# EAGLE design LoLin32-Lora (EAGLE 7.7.0)
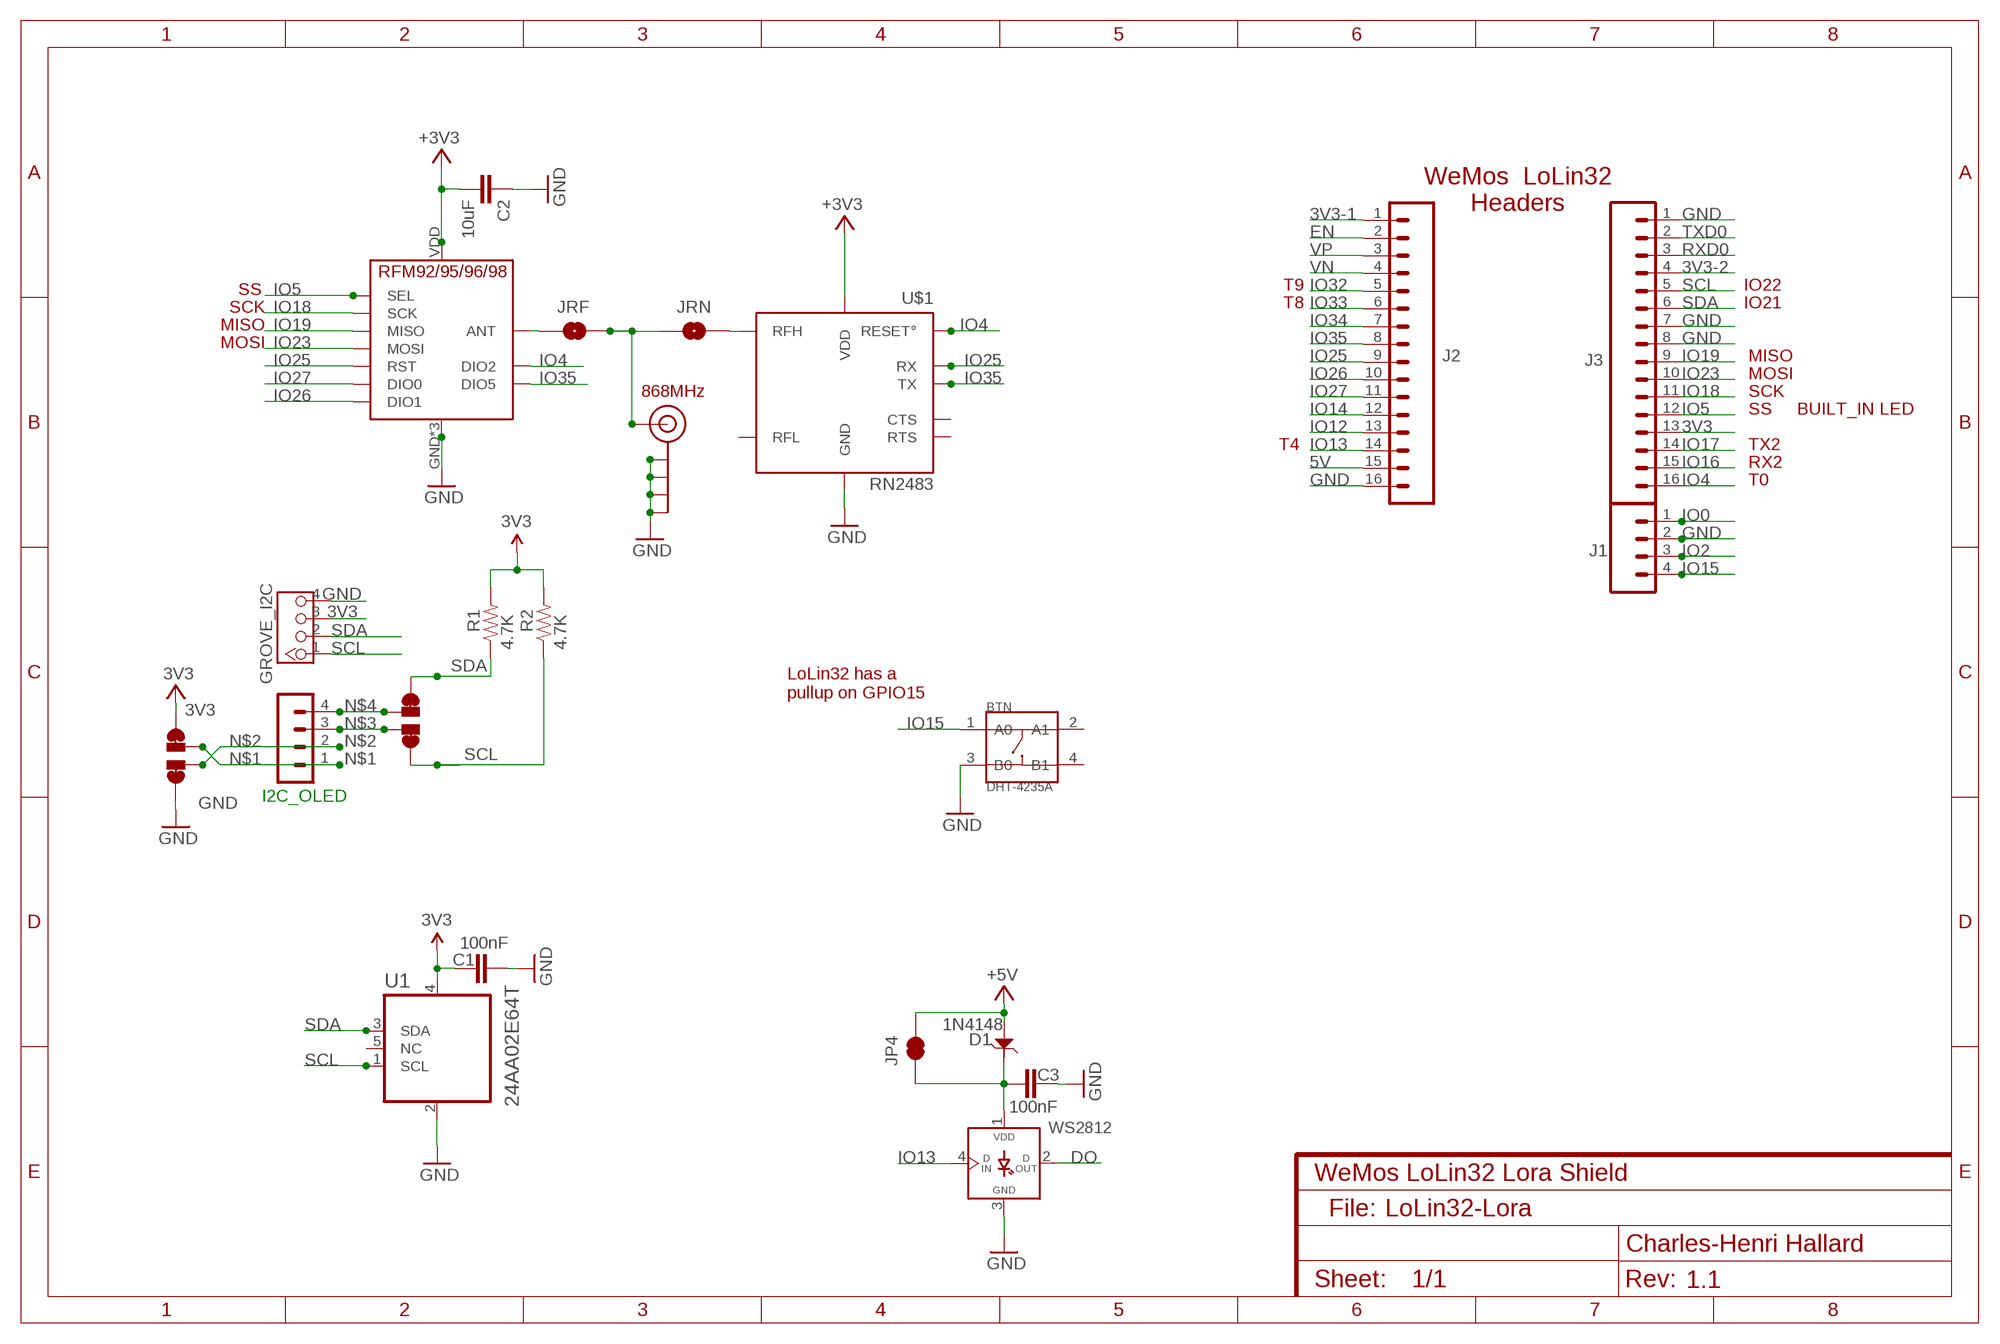
[diagram p0: schematic, sheet 1]
NAME (FRAME-A4L): CNAME: WeMos LoLin32 Lora Shield; CREVISION: 1.1; DESIGNER: Charles-Henri Hallard

## Parts
BTN  DHT-4235A  SMD-BUTTON-TOP-DHT-4235A(4P-4.2X3.2MM)  [SW4-SMD-4.2X3.2X2.5MM]
C1  100nF  CAP0805-CAP  [0805-CAP]
C2  10uF  CAP0805-CAP-LARGEPADS  [0805-CAP-LARGEPADS]
C3  100nF  CAP0805-CAP  [0805-CAP]
D1  1N4148  D-ESD-2P-CESD5V0D1  [SOD123-2.7X1.6]
GROVE_I2C  4P-2.0  GROVE-CONNECTOR-DIP(4P-2.0)  [HW4-2.0]
I2C_OLED  CON_HEADER_1X04'NO_LOCK'  [1X04_NO_LOCK]
J1  M041X04_NO_SILK  [1X04_NO_SILK]
J2  M161X16_NO_SILK  [1X16_NO_SILK]
J3  M161X16_NO_SILK  [1X16_NO_SILK]
J$2  ANTENNATINY  [SMA_UFL_PAD_TINY]
JP4  JUMPER-PAD-2-NC_BY_TRACE  [PAD-JUMPER-2-NC_BY_TRACE_YES_SILK]
JRF  JUMPER-PAD-2-NO  [PAD-JUMPER-2-NO_NO_SILK]
JRN  JUMPER-PAD-2-NO  [PAD-JUMPER-2-NO_NO_SILK]
R1  4.7K  RESISTOR0805-RES  [0805-RES]
R2  4.7K  RESISTOR0805-RES  [0805-RES]
U1  24AA02E64T  24AA02E64T-I/OT  [SOT95P270X145-5N]
U$1  RN2483  RN2483_NOGPIO868  [RN2483_NOGPIO_868]
U$2  PAD-JUMPER-SWAPSWAP  [PAD-JUMPER-SWAP]
U$3  PAD-JUMPER-SWAPSWAP  [PAD-JUMPER-SWAP]
U$5  RFM95  [RFM95]
WS2812  WS2812B  WS2812BSMD  [WS2812B]

## Nets
3V3: C2.2 GROVE_I2C.3 J3.13 R1.2 R2.2 U$1.VDD U$1.VDD2(VDD) U$2.4 U$2.44 U$5.VDD(VCC) ; supply symbol labelled +3V3
3V3-1: J2.1
3V3-2: C1.1 J3.4 U1.4(VCC) ; supply symbol labelled 3V3
5V: D1.1 J2.15 JP4.2 ; supply symbol labelled +5V
DO: WS2812.2(DOUT)
EN: J2.2
GND: BTN.3(B0) C1.2 C2.1 C3.2 GROVE_I2C.4 J1.2 J2.16 J3.1 J3.7 J3.8 J$2.GND1(GND) J$2.GND2(GND) J$2.GND3(GND) J$2.GND4(GND) U1.2(VSS) U$1.GND U$1.GND3(GND) U$1.GND4(GND) U$1.GND7(GND) U$1.GND9(GND) U$1.GND11(GND) U$1.GND12(GND) U$2.1 U$2.11 U$5.GND U$5.GND1(GND) U$5.GND2(GND) WS2812.3(GND)
IO0: J1.1
IO2: J1.3
IO4: J3.16 U$1.RESET° U$5.DIO2
IO5: J3.12 U$5.NSS(SEL)
IO12: J2.13
IO13: J2.14 WS2812.4(DIN)
IO14: J2.12
IO15: BTN.1(A0) J1.4
IO16: J3.15
IO17: J3.14
IO18: J3.11 U$5.SCK
IO19: J3.9 U$5.MISO
IO23: J3.10 U$5.MOSI
IO25: J2.9 U$1.UART_RX(RX) U$5.RST
IO26: J2.10 U$5.DIO1
IO27: J2.11 U$5.DIO0
IO32: J2.5
IO33: J2.6
IO34: J2.7
IO35: J2.8 U$1.UART_TX(TX) U$5.DIO5
N$1: I2C_OLED.1 U$2.3
N$2: I2C_OLED.2 U$2.2
N$3: I2C_OLED.3 U$3.2
N$4: I2C_OLED.4 U$3.3
N$5: JRN.2 U$1.RFH
N$6: JRF.1 U$5.ANT
N$7: J$2.ANT1(SIGNAL) J$2.ANT2(SIGNAL) J$2.ANT3(SIGNAL) JRF.2 JRN.1
RXD0: J3.3
SCL: GROVE_I2C.1 J3.5 R2.1 U1.1(SCL) U$3.1 U$3.11
SDA: GROVE_I2C.2 J3.6 R1.1 U1.3(SDA) U$3.4 U$3.44
TXD0: J3.2
VLED: C3.1 D1.2 JP4.1 WS2812.1(VDD)
VN: J2.4
VP: J2.3
Unconnected: BTN.2(A1) BTN.4(B1) U1.5(NC) U$1.RFL U$1.UART_CTS(CTS) U$1.UART_RTS(RTS)

## Notes on the sheet
- WeMos  LoLin32
  Headers
- SS | T9 | IO22
- SCK | T8 | IO21
- MISO
- MOSI
- MISO
- MOSI
- 868MHz | SCK
- SS | BUILT_IN LED
- T4 | TX2
- RX2
- T0
- LoLin32 has a 
  pullup on GPIO15
- File:

## Library data of the parts
BTN = Switch-2016:SMD-BUTTON-TOP-DHT-4235A(4P-4.2X3.2MM): 311020045; MPN: DHT-4235A
C1-C3 = _c2h:CAP: Capacitor Standard 0603 ceramic capacitor, and 0.1" leaded capacitor.
D1 = Seeed-Discrete:D-ESD-2P: Diodes for Protectiong against ESD
GROVE_I2C = _c2h:GROVE-CONNECTOR-DIP(4P-2.0): 320110033
I2C_OLED = _c2h:CON_HEADER_1X04
J1 = SparkFun-Connectors:M04: Header 4 Standard 4-pin 0.1" header. Use with straight break away headers (SKU : PRT-00116), right angle break away headers (PRT-00553), swiss pins (PRT-00743), machine pins (PRT-00117), and female headers (PRT-00115). Molex polarized connector foot print use with SKU : PRT-08231 with associated crimp pins and housings. 1MM SMD Version SKU: PRT-10208; PROD_ID: CONN-09696
J2 J3 = SparkFun-Connectors:M16: 1x16 .1" header
J$2 = _c2h:ANTENNA: SMA Antenna Connector End launch SMA connector. The paste layer has been removed so that the connector can be hand soldered onto the board after reflow.
JP4 = SparkFun-Passives:JUMPER-PAD-2-NC_BY_TRACE
JRF JRN = SparkFun-Passives:JUMPER-PAD-2-NO
R1 R2 = _c2h:RESISTOR: Resistor Basic schematic elements and footprints for 0603, 1206, and PTH resistors.
U1 = Microchip-24AA02E64T:24AA02E64T-I/OT: 2K I2C™ Serial EEPROMs, SOT23-5; MPN: 24AA02E64T-I/OT; OC_FARNELL: 2345567; OC_NEWARK: 01X0461; PACKAGE: SOT23-5; SUPPLIER: Microchip
U$1 = _c2h:RN2483_NOGPIO
U$2 U$3 = _c2h:PAD-JUMPER-SWAP
U$5 = _c2h:RFM95
WS2812 = _c2h:WS2812B

## Net classes
0 default: width 0.203 mm, drill 0.356 mm, clearance 0.152 mm
1 power: width 0.203 mm, clearance 0.152 mm

## Board
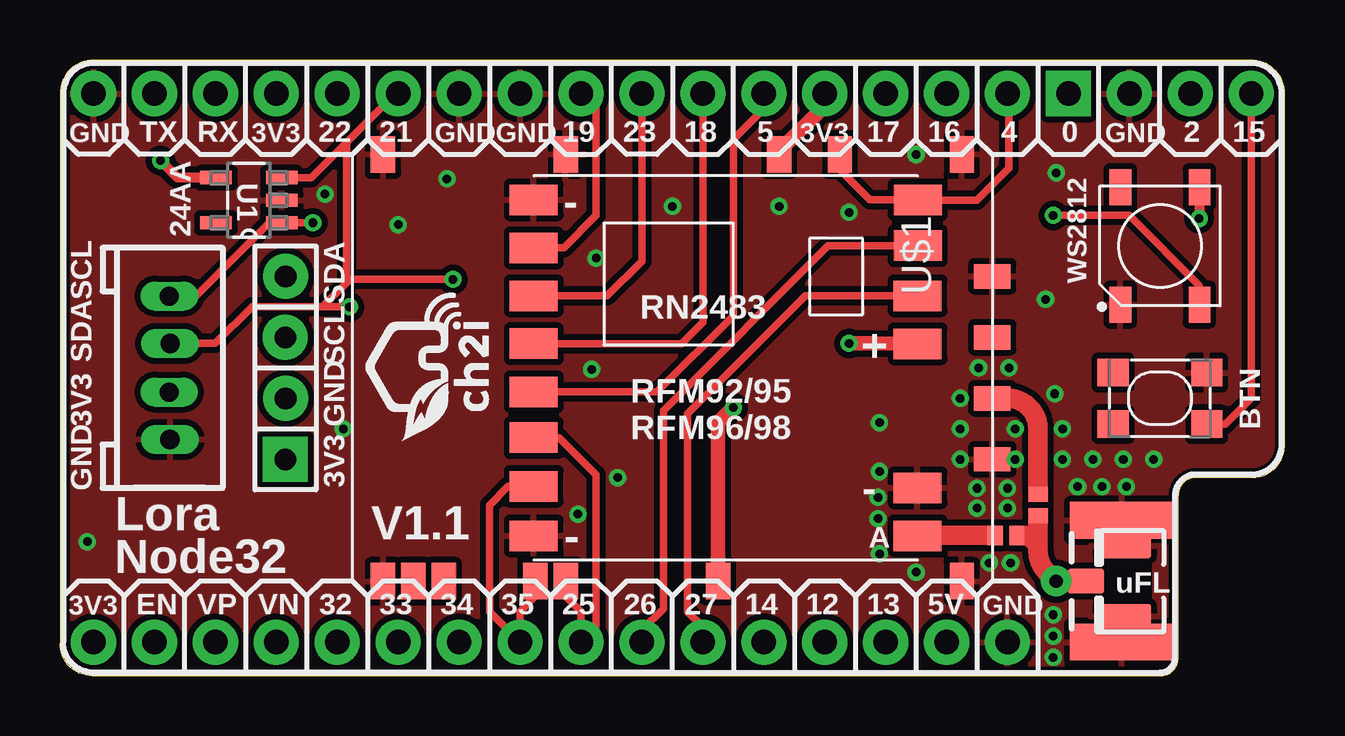
[diagram p1: board, top side]
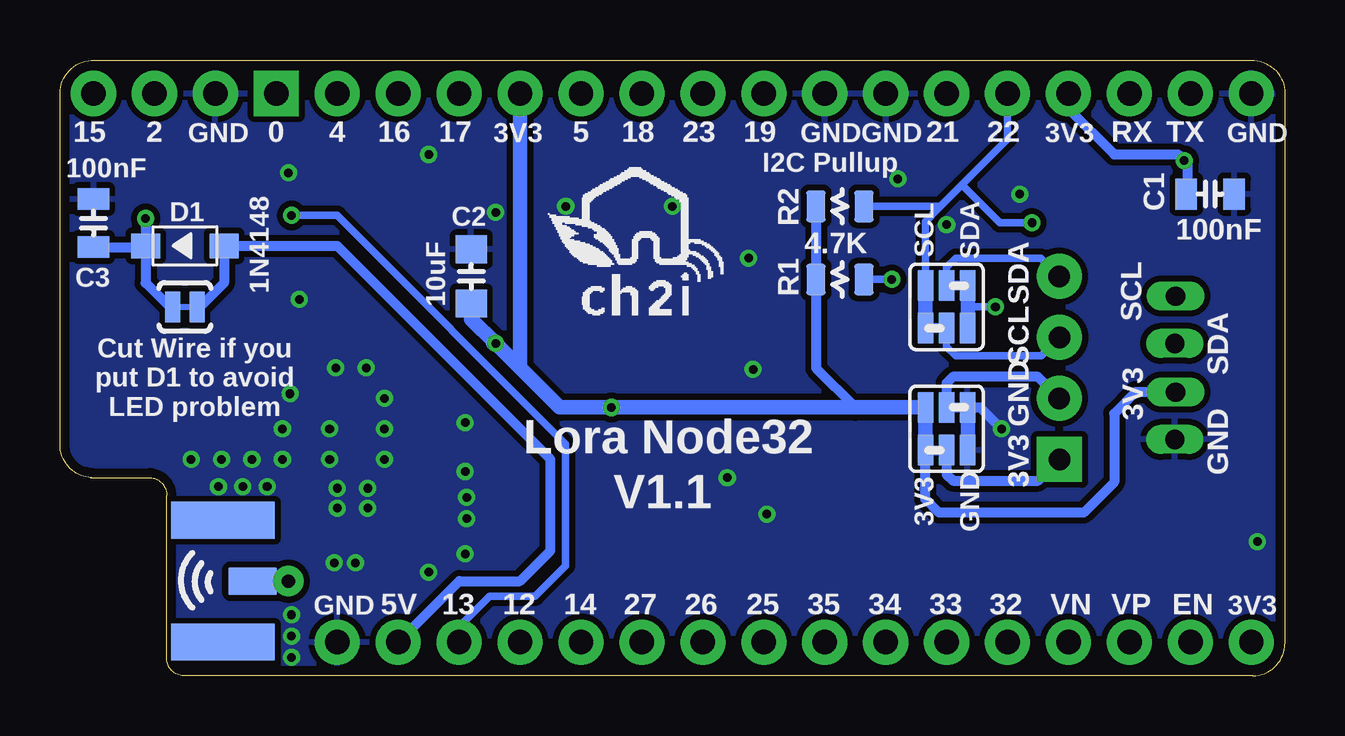
[diagram p2: board, bottom side, seen from below]

Size 51.05 x 25.65 mm. Coordinates in mm from the lower left corner, seen from the top.
Outline: 1.4,25.65 49.62,25.65 arc-90 51.05,24.26 51.05,9.65 arc-90 49.72,8.25
Outline: 1.4,25.65 1.37,25.65
Outline: 1.4,25.65 arc90 0,24.26 0,1.33 arc90 1.33,0 45.91,0 arc90 46.61,0.76 46.61,7.49 arc-90 47.31,8.25
Outline: 49.78,8.25 47.31,8.25
Outline: 47.31,8.25 47.24,8.25
Copper layers (1*16): Top 0.0356mm / dielectric 1.5011mm / Bottom 0.0356mm
Design rules "PCBs_io": minimum track width 6mil, minimum drill 13mil, track to track 6mil, track to pad 6mil, pad to pad 6mil, via to via 6mil, smd to smd 6mil, copper to edge 15mil, drill to drill 6mil, minimum pad ring 7mil, minimum via ring 7mil, stop-mask expansion 3mil, vias tented up to drill 40mil, thermal gap 10mil

### Footprints (pad centres in the part's own frame; a part is rotated, then mirrored left to right if it is on the bottom)
SW4-SMD-4.2X3.2X2.5MM = smd 1.3 x 1.15: 1 -1.95,1.075; 2 1.95,1.075; 3 -1.95,-1.075; 4 1.95,-1.075
0805-CAP = smd 0.902 x 1.3: 1 -1,0; 2 1,0
0805-CAP-LARGEPADS = smd 1.156 x 1.3: 1 -1.127,0; 2 1.127,0
SOD123-2.7X1.6 = smd 1.2 x 1.02: 1 -1.635,0; 2 1.635,0
HW4-2.0 = drill 0.8 pad 1.143 long: 1 -2.985,-0.015; 2 -1.016,0.016; 3 1.016,-0.016; 4 2.985,0.015
1X04_NO_LOCK = drill 0.9 pad 1.88 square: 1 -3.816,-0.121 | drill 0.9 pad 1.88: 2 -1.27,-0.133; 3 1.27,-0.121; 4 3.81,-0.133
1X04_NO_SILK = drill 1.016 pad 1.88 square: 1 0,0 | drill 1.016 pad 1.88: 2 2.54,0; 3 5.08,0; 4 7.62,0
1X16_NO_SILK = drill 1.016 pad 1.88: 1 0,0; 2 2.54,0; 3 5.08,0; 4 7.62,0; 5 10.16,0; 6 12.7,0; 7 15.24,0; 8 17.78,0; 9 20.32,0; 10 22.86,0; 11 25.4,0; 12 27.94,0; 13 30.48,0; 14 33.02,0; 15 35.56,0; 16 38.1,0
SMA_UFL_PAD_TINY = smd 1.524 x 1.016: ANT1 -3.843,0 | drill 0.559 pad 1.27: ANT2 -5.08,0 | smd 2.032 x 1.143 bottom: ANT3 -3.589,0 | smd 2.2 x 1.016: GND1 -2.223,1.47; GND2 -2.223,-1.47 | smd 4.318 x 1.524: GND3 -2.349,-2.54; GND4 -2.349,2.54 | smd 4.318 x 1.524 bottom: GND5 -2.349,2.54; GND6 -2.349,-2.54
PAD-JUMPER-2-NC_BY_TRACE_YES_SILK = smd 0.635 x 1.27: 1 -0.508,0; 2 0.508,0
PAD-JUMPER-2-NO_NO_SILK = smd 0.635 x 0.813: 1 -0.45,0; 2 0.45,0
0805-RES = smd 0.8 x 1.3: 1 -1,0; 2 1,0
SOT95P270X145-5N = smd 1.321 x 0.559: 1 -1.372,0.94; 2 -1.372,0; 3 -1.372,-0.94; 4 1.372,-0.94; 5 1.372,0.94
RN2483_NOGPIO_868 = smd 1.524 x 1.016: GND 17.78,1.27; GND3 17.78,25.4; GND9 0,25.4; GND11 0,8.89; GND12 0,1.27; RESET° 0,20.32; UART_CTS 17.78,3.81; UART_RTS 17.78,2.54; UART_RX 17.78,8.89; UART_TX 17.78,7.62; VDD 17.78,15.24; VDD2 0,17.78 | smd 1.016 x 1.524: GND4 12.7,26.67; GND7 5.08,26.67; RFH 10.16,26.67; RFL 7.62,26.67
PAD-JUMPER-SWAP = smd 0.635 x 1.27: 1 -0.876,0.889; 2 0,-0.889; 3 0,0.889; 4 0.876,-0.889; 11 -0.876,-0.889; 44 0.876,0.889
RFM95 = smd 2 x 1.27: ANT 5.777,-7; DIO0 5.777,3; DIO1 5.779,5.095; DIO2 5.779,7; DIO5 -10.225,-4.936; GND 5.777,-5; GND1 -10.223,7; GND2 -10.23,-7; MISO -10.23,5; MOSI -10.225,3; NSS -10.223,-1; RST -10.223,-2.905; SCK -10.23,1.012; VDD 5.777,1
WS2812B = smd 1.5 x 0.9: 1 2.45,-1.65; 2 2.45,1.65; 3 -2.45,1.65; 4 -2.45,-1.65

### Placement (x,y rotation side)
BTN  45.85,11.56 180 top
C1  3.11,20.07 0 bottom
C2  33.91,16.64 270 bottom
C3  49.66,18.86 90 bottom
D1  45.85,17.91 180 bottom
GROVE_I2C  4.57,12.83 270 top
I2C_OLED  9.27,12.83 90 top
J1  42.04,24.26 0 top
J2  1.4,1.4 0 top
J3  1.4,24.26 0 top
J$2  46.61,3.94 0 top
JP4  45.85,15.37 0 bottom
JRF  39.43,5.84 0 top
JRN  40.77,7.11 90 top
R1  18.54,16.51 180 bottom
R2  18.54,19.56 180 bottom
U1  7.87,19.81 180 top
U$1  12.19,21.72 270 top
U$2  14.1,10.29 180 bottom
U$3  14.1,15.37 0 bottom
U$4  [LOGO_CH2I_75MM]  26.61,17.02 0 bottom
U$5  29.97,12.83 0 top
U$6  [LOGO_C2I_015]  17.91,9.78 90 top
WS2812  45.85,17.91 90 top

### Tracks (layer width: path | path; a pad name or v marks a point on that pad's centre or on a via)
3V3  (via drill 0.36 pad 0.71)
  Top 0.61: v32.89,13.84 33.86,13.84 U$5.VDD | U$1.VDD2 29.97,21.84 31.88,23.75 J3.13 | U$1.VDD 27.43,10.54 v28.07,11.18
  Bottom 0.406: 14.99,11.19 U$2.4 U$2.44 14.99,9.38 14.99,7.37 14.41,6.79 8.38,6.79 7.11,8.06 7.11,10.92 6.22,11.81 GROVE_I2C.3 | R2.2 R1.2 19.54,12.81 17.91,11.18
  Bottom 0.61: J3.13 31.88,12.83 | U$2.4 17.91,11.18 v28.07,11.18 30.23,11.18 31.88,12.83 | C2.2 33.91,14.86 v32.89,13.84 | 33,13.84 v32.89,13.84 | v32.89,13.84 31.88,12.83
3V3-2  (via drill 0.36 pad 0.71)
  Top 0.406: U1.4 4.9,20.75 v4.19,21.46
  Bottom 0.406: J3.4 9.02,23.62 7.11,21.72 4.45,21.72 v4.19,21.46 4.06,21.34 4.06,20.4 C1.1
5V
  Bottom 0.406: JP4.2 45.21,15.37 44.21,16.37 D1.1 39.5,17.91 30.61,9.02 30.61,5.21 31.88,3.94 34.42,3.94 J2.15
GND  (via drill 0.36 pad 0.71)
  Bottom 0.406: U$2.11 12.7,11.18 v11.81,10.29
  other vias: 11.05,20.07 16.13,20.7 25.53,19.56 14.1,18.8 45.59,9.02 1.14,5.59 32.89,19.3 23.24,8.25 41.4,2.54 41.4,1.65 41.4,0.76 42.42,7.87 43.43,7.87 44.45,7.87 41.08,15.68 35.69,4.32 21.59,6.73 44.32,9.02 43.05,9.02 41.53,20.95 39.5,6.98 39.5,7.81 38.23,7.81 38.23,6.98 39.62,4.7 38.73,4.7 41.78,9.02 41.78,10.29 41.47,11.75 39.81,9.02 39.56,12.83 38.29,12.83 37.53,11.56 37.53,9.02 34.1,6.54 34.1,7.43 34.16,8.51 34.16,5.08 34.16,10.54 37.53,10.29 39.81,10.29 29.97,19.56 22.16,12.76 35.69,21.72 22.35,17.4
  pour Bottom (isolate 0.254): 52.2,26.8 52.2,-1.14 -1.14,-1.14 -1.14,26.8
  pour Top (isolate 0.254): -0.51,26.16 51.56,26.16 51.56,-0.51 -0.51,-0.51
IO4
  Top 0.305: J3.16 39.56,24.19 39.56,21.15 38.23,19.81 35.77,19.81 U$5.DIO2 33.77,19.83 32.51,21.08 U$1.RESET°
IO5
  Top 0.305: U$5.NSS 24.89,11.83 28.07,15 28.07,22.35 29.34,23.62 J3.12
IO13  (via drill 0.36 pad 0.71)
  Top 0.305: 47.5,15.11 WS2812.4 47.5,16.26 44.58,19.18 v41.4,19.18
  Bottom 0.305: v41.4,19.18 39.5,19.18 29.97,9.65 29.97,4.57 31.24,3.3 33.15,3.3 34.42,2.03 J2.14
IO15
  Top 0.305: J1.4 49.66,11.56 48.58,10.48 BTN.1
IO18
  Top 0.305: U$5.SCK 25.9,13.84 26.8,14.73 J3.11
IO19
  Top 0.305: U$5.MISO 21,17.83 22.35,19.18 22.35,23.62 J3.9
IO23
  Top 0.305: J3.10 24.26,17.27 22.81,15.83 U$5.MOSI
IO25
  Top 0.305: U$5.RST 20.81,9.92 22.35,8.38 22.35,2.03 J2.9 21.72,2.67 21.08,3.3 U$1.UART_RX
IO26
  Top 0.305: U$5.DIO1 32.02,17.92 25.15,11.05 25.15,2.79 24.26,1.9 J2.10
IO27
  Top 0.305: U$5.DIO0 31.07,15.83 26.16,10.92 26.16,2.67 26.8,2.03 J2.11
IO35
  Top 0.305: U$5.DIO5 18.69,7.89 17.91,7.11 17.91,2.67 J2.8 19.18,2.67 19.81,3.3 U$1.UART_TX
N$1
  Bottom 0.406: U$2.3 14.1,8.38 13.84,8.13 10.27,8.13 I2C_OLED.1
N$2
  Bottom 0.406: U$2.2 14.1,12.19 13.84,12.45 10.29,12.45 I2C_OLED.2
N$3
  Bottom 0.305: U$3.2 14.1,13.72 13.72,13.34 10.15,13.34 I2C_OLED.3
N$4
  Bottom 0.305: U$3.3 14.1,17.02 13.72,17.4 10.17,17.4 I2C_OLED.4
N$5
  Top 0.61: JRN.2 40.77,7.75
  Top 0.813: U$1.RFH 39.5,11.56 arc-90 40.77,10.29 40.77,7.75
N$6
  Top 0.61: JRF.1 38.67,5.84
  Top 0.813: 35.76,5.84 arc90 U$5.ANT arc-90 35.76,5.84 | 38.67,5.84 35.76,5.84
N$7
  Top 0.61: JRN.1 40.77,6.48 | JRF.2 40.13,5.84 | J$2.ANT2 42.04,3.94
  Top 0.813: J$2.ANT1 42.04,3.94 arc-90 40.77,5.21 | 40.2,5.84 40.13,5.84 arc-90 40.77,5.21 | 40.77,6.48 40.77,5.21
  Bottom 0.61: J$2.ANT3 J$2.ANT2
SCL  (via drill 0.36 pad 0.71)
  Top 0.305: U1.1 v10.54,18.87 8.71,18.87 5.65,15.81 GROVE_I2C.1
  Bottom 0.305: 14.99,16.27 U$3.1 | 14.99,16.27 14.99,14.49 U$3.11 | J3.5 11.56,22.35 13.46,20.45 | 14.99,16.27 14.99,18.92 14.41,19.49 | 14.41,19.49 13.46,20.45 | R2.1 14.48,19.56 14.41,19.49 | 13.46,20.45 11.89,18.87 v10.54,18.87
SDA  (via drill 0.36 pad 0.71)
  Top 0.305: GROVE_I2C.2 6.48,13.84 8,15.37 10.92,15.37 | 10.92,15.37 v12.07,15.37 | 11.94,16.38 10.92,15.37 | 11.94,22.23 11.94,16.38 | J3.6 13.97,24.26 11.94,22.23 | U1.3 10.46,20.75 11.94,22.23 | v16.38,16.51 12.07,16.51 11.94,16.38
  Bottom 0.305: U$3.44 13.22,15.37 | 13.22,15.37 U$3.4 | v12.07,15.37 13.22,15.37 | R1.1 v16.38,16.51
VLED  (via drill 0.36 pad 0.71)
  Top 0.406: WS2812.1 47.5,20.34 v47.48,19.05
  Bottom 0.406: JP4.1 46.48,15.37 47.48,16.37 D1.2 | v47.48,19.05 D1.2 | C3.1 47.53,17.86 D1.2

### Text on the board
tNames: GND | TX | RX | 3V3 | 22 | 21 | GND | GND | 19 | 23 | 18 | 5 | 3V3 | 17 | 16 | 4 | 0 | GND | 2 | 15 | 24AA | SCL | SDA | SDA | SCL | RFM92/95 / RFM96/98 | 3V3 | GND | GND | 3V3 | Lora | V1.1 | Node32 | 3V3 | EN | VP | VN | 32 | 33 | 34 | 35 | 25 | 26 | 27 | 14 | 12 | 13 | 5V | GND
bNames: GND | TX | RX | 3V3 | 22 | 21 | GND | GND | 19 | 23 | 18 | 5 | 3V3 | 17 | 16 | 4 | 0 | GND | 2 | 15 | I2C Pullup | SDA | SCL | SDA | SCL | SDA | SCL | Cut Wire if you / put D1 to avoid / LED problem | GND | 3V3 | GND | Lora Node32 | 3V3 | V1.1 | GND | 3V3 | 3V3 | EN | VP | VN | 32 | 33 | 34 | 35 | 25 | 26 | 27 | 14 | 12 | 13 | 5V | GND